# Altium schematic sheet P1.schdoc
size 297 x 209 mm; Symbol: Drawing-Symbol_A4; Company: 嘉立创EDA; Version: V1.0; Page Size: A4; @Project Name: midi; @Update Date: 2026-01-07; @Create Date: 2026-01-07; Device: Drawing-Symbol_A4; @Board Name: Board1; @Page Name: P1; @Create Time: 17:49:35; @Page Count: 1; @Page No: 1; @Schematic Name: Schematic1; @Update Time: 17:49:35; @Assembly Variant: Basic; Border: 1; Title Block Position: 3; Size: A4; Width: 1170; Height: 825; Region Start: 1; X Region Count: 6; Y Region Count: 4; Blade Width: 10; Title Block: 1
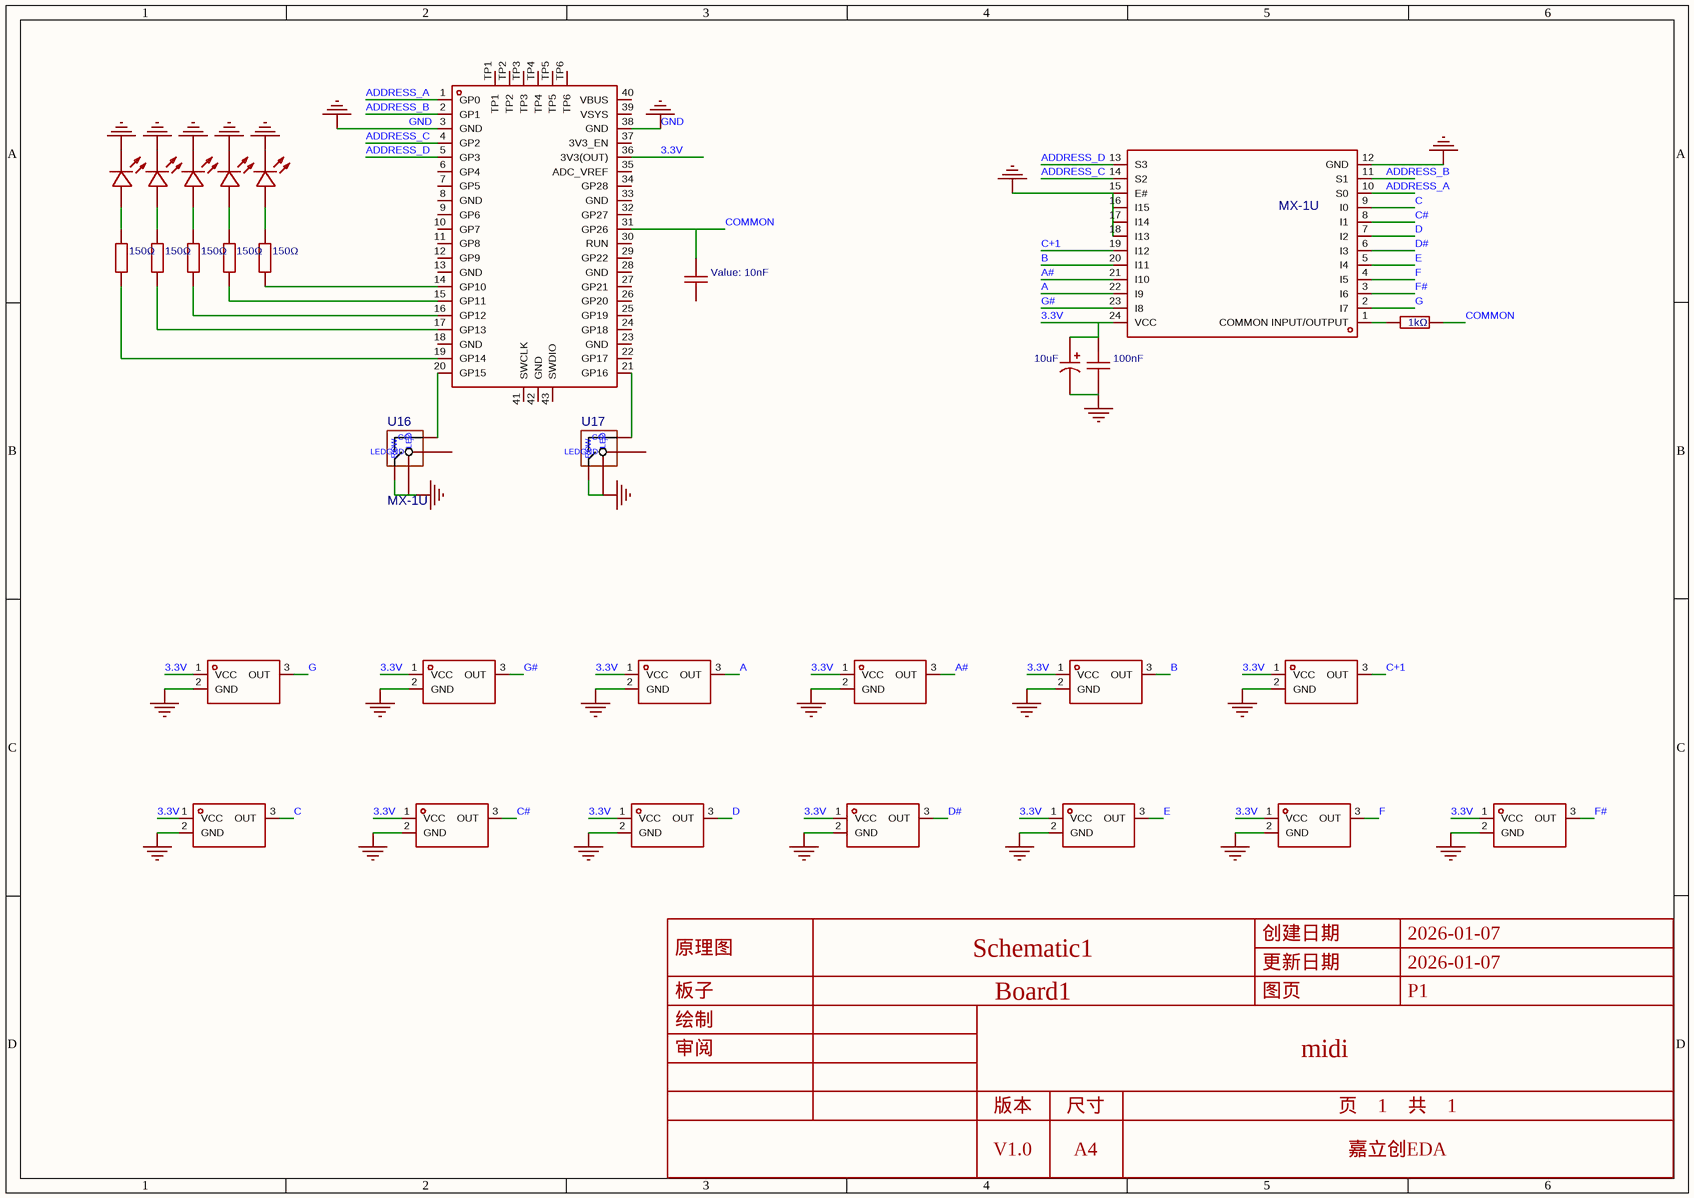
[diagram p0: P1.schdoc]

## Parts
C1  10nF  [C0805]
C2  100nF  [C0603]
C3  10uF  [CAP-SMD_BD5.0-L5.3-W5.3-LS6.0-FD]
LED0  NCD0603Y2  [LED0603-RD]  (value not drawn)
LED1  NCD0603Y2  [LED0603-RD]  (value not drawn)
LED2  NCD0603Y2  [LED0603-RD]  (value not drawn)
LED3  NCD0603Y2  [LED0603-RD]  (value not drawn)
LED4  NCD0603Y2  [LED0603-RD]  (value not drawn)
R1  1kΩ  [R0603]
R2  150Ω  [R0603]
R3  150Ω  [R0603]
R4  150Ω  [R0603]
R5  150Ω  [R0603]
R6  150Ω  [R0603]
U1  PICO  [COMM-SMD_L51.0-W21.0-P2.54_SC0916]  (value not drawn)
U2  CD74HC4067M96  [SOIC-24_L15.4-W7.5-P1.27-LS10.3-BL]  (value not drawn)
U3  HAL403SO  [SOT-23-3_L2.9-W1.3-P1.90-LS2.4-BR-CW]  (value not drawn)
U4  HAL403SO  [SOT-23-3_L2.9-W1.3-P1.90-LS2.4-BR-CW]  (value not drawn)
U5  HAL403SO  [SOT-23-3_L2.9-W1.3-P1.90-LS2.4-BR-CW]  (value not drawn)
U6  HAL403SO  [SOT-23-3_L2.9-W1.3-P1.90-LS2.4-BR-CW]  (value not drawn)
U7  HAL403SO  [SOT-23-3_L2.9-W1.3-P1.90-LS2.4-BR-CW]  (value not drawn)
U8  HAL403SO  [SOT-23-3_L2.9-W1.3-P1.90-LS2.4-BR-CW]  (value not drawn)
U9  HAL403SO  [SOT-23-3_L2.9-W1.3-P1.90-LS2.4-BR-CW]  (value not drawn)
U10  HAL403SO  [SOT-23-3_L2.9-W1.3-P1.90-LS2.4-BR-CW]  (value not drawn)
U11  HAL403SO  [SOT-23-3_L2.9-W1.3-P1.90-LS2.4-BR-CW]  (value not drawn)
U12  HAL403SO  [SOT-23-3_L2.9-W1.3-P1.90-LS2.4-BR-CW]  (value not drawn)
U13  HAL403SO  [SOT-23-3_L2.9-W1.3-P1.90-LS2.4-BR-CW]  (value not drawn)
U14  HAL403SO  [SOT-23-3_L2.9-W1.3-P1.90-LS2.4-BR-CW]  (value not drawn)
U15  HAL403SO  [SOT-23-3_L2.9-W1.3-P1.90-LS2.4-BR-CW]  (value not drawn)
U16  MX-1U  [CHERRY MX 1U]
U17  MX-1U  [CHERRY MX 1U]

## Nets
GND: C2.1 C3.2 LED0.1(K) LED1.1(K) LED2.1(K) LED3.1(K) LED4.1(K) U1.3(GND) U1.38(GND) U2.12(GND) U2.15(E#) U2.16(I15) U2.17(I14) U2.18(I13) U3.2(GND) U4.2(GND) U5.2(GND) U6.2(GND) U7.2(GND) U8.2(GND) U9.2(GND) U10.2(GND) U11.2(GND) U12.2(GND) U13.2(GND) U14.2(GND) U15.2(GND) U16.LED U16.ROW U17.LED U17.ROW
3.3V: C2.2 C3.1 U1.36(3V3(OUT)) U2.24(VCC) U3.1(VCC) U4.1(VCC) U5.1(VCC) U6.1(VCC) U7.1(VCC) U8.1(VCC) U9.1(VCC) U10.1(VCC) U11.1(VCC) U12.1(VCC) U13.1(VCC) U14.1(VCC) U15.1(VCC)
A: U2.22(I9) U13.3(OUT)
A#: U2.21(I10) U14.3(OUT)
ADDRESS_A: U1.1(GP0) U2.10(S0)
ADDRESS_B: U1.2(GP1) U2.11(S1)
ADDRESS_C: U1.4(GP2) U2.14(S2)
ADDRESS_D: U1.5(GP3) U2.13(S3)
B: U2.20(I11) U15.3(OUT)
C: U2.9(I0) U3.3(OUT)
C#: U2.8(I1) U4.3(OUT)
C+1: U2.19(I12) U11.3(OUT)
COMMON: C1.2 R1.2 U1.31(GP26)
D: U2.7(I2) U5.3(OUT)
D#: U2.6(I3) U6.3(OUT)
E: U2.5(I4) U7.3(OUT)
F: U2.4(I5) U8.3(OUT)
F#: U2.3(I6) U9.3(OUT)
G: U2.2(I7) U10.3(OUT)
G#: U2.23(I8) U12.3(OUT)
NetLED0_2: LED0.2(A) R2.2
NetLED1_2: LED1.2(A) R3.2
NetLED2_2: LED2.2(A) R4.2
NetLED3_2: LED3.2(A) R5.2
NetLED4_2: LED4.2(A) R6.2
NetR1_1: R1.1 U2.1(COMMON_INPUT/OUTPUT)
NetR2_1: R2.1 U1.14(GP10)
NetR3_1: R3.1 U1.15(GP11)
NetR4_1: R4.1 U1.16(GP12)
NetR5_1: R5.1 U1.17(GP13)
NetR6_1: R6.1 U1.19(GP14)
NetU1_20: U1.20(GP15) U16.COL
NetU1_21: U1.21(GP16) U17.COL

Not connected (* = marked no-connect by the designer): C1 1; U1 6(GP4) 7(GP5) 8(GND) 9(GP6) 10(GP7) 11(GP8) 12(GP9) 13(GND) 18(GND) 22(GP17) 23(GND) 24(GP18) 25(GP19) 26(GP20) 27(GP21) 28(GND) 29(GP22) 30(RUN) 32(GP27) 33(GND) 34(GP28) 35(ADC_VREF) 37(3V3_EN) 39(VSYS) 40(VBUS) 41(SWCLK) 42(GND) 43(SWDIO) TP1 TP2 TP3 TP4 TP5 TP6; U16 LEDGND; U17 LEDGND

## Notes on the sheet
- 创建日期
- 2026-01-07
- 原理图
- 板子
- Schematic1
- Board1
- 更新日期
- 图页
- P1
- 绘制
- 审阅
- midi
- 版本
- V1.0
- 尺寸
- A4
- 页    1    共    1
- 嘉立创EDA

## Library data of the parts
C1 = CL21B103KBANNNC: 容值:10nF;精度:±10%;额定电压:50V;温度系数:X7R;; Manufacturer: SAMSUNG(三星); AddInBom: yes; ModelId: 1ba041120af144c991958decab20d2410819f05c4eef4c71ace90d822a990e87; ModelName: C0805_L2.0-W1.3-H1.3; ModelTransform: 78.74,51.181,0,0,0,0,0,0.0005,0; Tolerance: ±10%; Voltage Rating: 50V; Temperature Coefficient: X7R; Symbol: CL21B103KBANNNC; Device: CL21B103KBANNNC; Value: 10nF; LCSC Part Name: 10nF ±10% 50V; SupplierPart: C1710; ManufacturerPart: CL21B103KBANNNC; Supplier Footprint: 0805; JLCPCB Part Class: Basic Part; Datasheet: https://item.szlcsc.com/datasheet/CL21B103KBANNNC/2062.html; Supplier: LCSC; ConvertToPcb: yes; FootprintName: C0805
C2 = CGA0603X7R104K500JT: 容值:100nF;精度:±10%;额定电压:50V;温度系数:X7R;; Manufacturer: HRE(芯声); AddInBom: yes; ModelId: ac125912035d415993ca9572d50418b10819f05c4eef4c71ace90d822a990e87; ModelName: C0603_L1.6-W0.8-H0.8; ModelTransform: 62.992,31.496,0,0,0,0,0,0,0; Tolerance: ±10%; Voltage Rating: 50V; Temperature Coefficient: X7R; Symbol: CGA0603X7R104K500JT; Device: CGA0603X7R104K500JT; Value: 100nF; LCSC Part Name: 100nF ±10% 50V; SupplierPart: C6119867; ManufacturerPart: CGA0603X7R104K500JT; Supplier Footprint: 0603; JLCPCB Part Class: Extended Part; Datasheet: https://item.szlcsc.com/datasheet/CGA0603X7R104K500JT/7062573.html; Supplier: LCSC; ConvertToPcb: yes; FootprintName: C0603
C3 = JVJ50v10M5x5: 容值:10uF;精度:±20%;额定电压:50V;纹波电流:18mA@120Hz;; Manufacturer: JIERR(捷而瑞); AddInBom: yes; ModelId: ed942b427de741e3aabba01c64b2d7230819f05c4eef4c71ace90d822a990e87; ModelTransform: 236.22,208.661,0,0,0,0,-0.001,-0.003,0; Tolerance: ±20%; Voltage Rating: 50V; Lifetime: 2000hrs@105℃; Symbol: JVJ50V10M5X5; Device: JVJ50v10M5x5; Value: 10uF; Manufacturer Part: JVJ50v10M5x5; LCSC Part Name: 10uF ±20% 50V; SupplierPart: C46550416; Supplier Footprint: SMD,D5xL5.4mm; JLCPCB Part Class: Extended Part; Datasheet: https://item.szlcsc.com/datasheet/JVJ50v10M5x5/48680110.html; Supplier: LCSC; ConvertToPcb: yes; FootprintName: CAP-SMD_BD5.0-L5.3-W5.3-LS6.0-FD; ModelName: CAP-SMD_BD5.0-L5.3-W5.3-LS6.0-FD; Ripple Current: 18mA@120Hz; Diameter: 5mm; Height - Seated (Max): 5.4mm; Operating Temperature: -55℃~+105℃
LED0-LED4 = NCD0603Y2: 发光颜色:黄色;正向电压(VF):1.6V~2.6V;功率:65mW;正向电流:20mA;主波长:586nm~595nm;透镜颜色:无色透明透镜;发光强度:100mcd~220mcd;发光角度:130°;工作温度:-30℃~+85℃;; Manufacturer: 国星光电; Symbol: FC-1608YXK-585F08; AddInBom: yes; ModelId: 1f0d29a91be547639d425604e9b96ebb0819f05c4eef4c71ace90d822a990e87; ModelTransform: 63.7794,32.283,0,0,0,0,0,0,0; Emitted Color: 黄色; Power Dissipation: 65mW; Forward Current: 20mA; Lens Color: 无色透明透镜; Viewing Angle: 130°; Device: NCD0603Y2; LCSC Part Name: NCD0603Y2; SupplierPart: C89811; ManufacturerPart: NCD0603Y2; Supplier Footprint: 0603; JLCPCB Part Class: Extended Part; Datasheet: https://atta.szlcsc.com/upload/public/pdf/source/20200820/C89811_7FE84B429B6BCA3E113B125EE1452576.pdf; Supplier: LCSC; ConvertToPcb: yes; FootprintName: LED0603-RD; ModelName: LED0603-RD; Forward Voltage (VF): 1.6V~2.6V; Dominant Wavelength: 586nm~595nm; Luminous Intensity: 100mcd~220mcd; Operating Temperature: -30℃~+85℃
R1 = 0603WAF1001T5E: 电阻类型:厚膜电阻;阻值:1kΩ;精度:±1%;功率:100mW;工作电压:75V;温度系数:±100ppm/℃;; Manufacturer: UNI-ROYAL(厚声); AddInBom: yes; ModelId: fc143cca1e79419f9cd78b61e9279f080819f05c4eef4c71ace90d822a990e87; ModelTransform: 31.8897,63.7794,0,90,0,0,0,0,0; Tolerance: ±1%; Power(Watts): 100mW; Voltage-Supply(Max): 75V; Symbol: 0603WAF1001T5E; Device: 0603WAF1001T5E; Value: 1kΩ; LCSC Part Name: 1kΩ ±1% 100mW 厚膜电阻; SupplierPart: C21190; ManufacturerPart: 0603WAF1001T5E; Supplier Footprint: 0603; JLCPCB Part Class: Basic Part; Datasheet: https://item.szlcsc.com/datasheet/0603WAF1001T5E/21904.html; Supplier: LCSC; ConvertToPcb: yes; FootprintName: R0603; ModelName: R0603; Type: 厚膜电阻; Temperature Coefficient: ±100ppm/℃; Operating Temperature: -55℃~+155℃
R2-R6 = 0603WAF1500T5E: 电阻类型:厚膜电阻;阻值:150Ω;精度:±1%;功率:100mW;最大工作电压:75V;温度系数:±100ppm/℃;; Manufacturer: UNI-ROYAL(厚声); AddInBom: yes; ModelId: fc143cca1e79419f9cd78b61e9279f080819f05c4eef4c71ace90d822a990e87; ModelTransform: 31.8897,63.7794,0,90,0,0,0,0,0; Tolerance: ±1%; Power(Watts): 100mW; Overload Voltage (Max): 75V; Symbol: 0603WAF1500T5E; Device: 0603WAF1500T5E; Value: 150Ω; LCSC Part Name: 150Ω ±1% 100mW 厚膜电阻; SupplierPart: C22808; ManufacturerPart: 0603WAF1500T5E; Supplier Footprint: 0603; JLCPCB Part Class: Basic Part; Datasheet: https://atta.szlcsc.com/upload/public/pdf/source/20200306/C422600_1E6D84923E4A46A82E41ADD87F860B5C.pdf; Supplier: LCSC; ConvertToPcb: yes; FootprintName: R0603; ModelName: R0603; Type: 厚膜电阻; Temperature Coefficient: ±100ppm/℃; Operating Temperature Range: -55℃~+155℃
U1 = PICO: "基于Raspberry Pi RP2040芯片设计；处理器：双核Arm Cortex-M0+ @ 133MHz内存：264KB片上SRAM；2MB板上QSPI闪存接口：26个GPIO引脚，包括3个模拟输入；2 × UART；2 × SPI控制器；2 × I2C控制器；16个PWM通道；1 × USB 1.1控制器和PHY，支持主机和设备；8 × PIO状态机"; Manufacturer: Raspberry Pi(树莓派); AddInBom: yes; Symbol: PICO; Device: PICO; LCSC Part Name: PICO; SupplierPart: C7203002; ManufacturerPart: PICO; Supplier Footprint: -; JLCPCB Part Class: Extended Part; Datasheet: https://item.szlcsc.com/datasheet/PICO/8170960.html; Supplier: LCSC; ConvertToPcb: yes; FootprintName: COMM-SMD_L51.0-W21.0-P2.54_SC0916
U2 = CD74HC4067M96: 开关电路:-;通道数:-;导通电阻(Ron):70Ω;; Manufacturer: TI(德州仪器); 3D Model: 445687b1d31f499ea3a6d4f07b6074ed0819f05c4eef4c71ace90d822a990e87; 3D Model Transform: 606.298,406.49525,0,0,0,0,0,0,0; Voltage - Supply: 2V~6V; Turn-on time: 83ns; Ron: 70Ω; Bandwidth: 89MHz; Propagation Delay (tpd): 15ns; AddInBom: yes; ModelName: SOIC-24_L15.4-W7.5-H2.7-LS10.3-P1.27; Symbol: CD74HC4067M96; Device: CD74HC4067M96; LCSC Part Name: 高速CMOS逻辑16通道模拟多路复用器/解复用器; Supplier Part: C496123; Manufacturer Part: CD74HC4067M96; Supplier Footprint: SOIC-24-300mil; JLCPCB Part Class: Extended Part; Datasheet: https://www.ti.com/cn/lit/gpn/cd74hc4067; Supplier: LCSC; Switch Circuit: -; Number of Channels: -; Turn-off time: 83ns; Operating Temperature: -55℃~+125℃; ConvertToPcb: yes; FootprintName: SOIC-24_L15.4-W7.5-P1.27-LS10.3-BL
U3-U15 = HAL403SO: 磁轴键盘线性霍尔元件，运动检测，摇杆; Manufacturer: Hallwee(霍尔微电子); AddInBom: yes; ModelId: 0cd8f516735c4ef2b3b431ec551e11b80819f05c4eef4c71ace90d822a990e87; ModelTransform: 102.362,114.173,0,0,0,0,0,0,0; Magnetic Field Range: ±50mT; Sensitivity: 4.1mV/Gs; Linearity: ±1.5%; Voltage - Supply: 1.6V~3.6V; Supply Current: 1.4mA; Symbol: HAL403SO; Device: HAL403SO; LCSC Part Name: HAL403SO; SupplierPart: C42387470; ManufacturerPart: HAL403SO; Supplier Footprint: SOT-23-3L; JLCPCB Part Class: Extended Part; Datasheet: https://item.szlcsc.com/datasheet/HAL403SO/44312210.html; Supplier: LCSC; ConvertToPcb: yes; FootprintName: SOT-23-3_L2.9-W1.3-P1.90-LS2.4-BR-CW; ModelName: SOT-23-3_L2.9-W1.3-P1.90-LS2.4-BR-CW; Operating Temperature: -40℃~+150℃
U16 U17 = MX-1U: ConvertToPcb: yes; OriginFootprint: CHERRY_MX_1U; Symbol: MX-1U; Device: MX-1U; AddInBom: yes